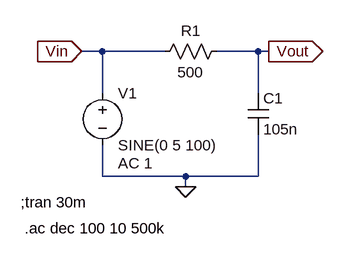
[diagram p0: schematic Draft10.asc]
Draft10.asc, the LTspice schematic file:
Version 4
SHEET 1 880 680
WIRE 16 48 -16 48
WIRE 112 48 16 48
WIRE 256 48 192 48
WIRE 272 48 256 48
WIRE 16 112 16 48
WIRE 256 112 256 48
WIRE 16 240 16 192
WIRE 144 240 16 240
WIRE 256 240 256 176
WIRE 256 240 144 240
WIRE 144 256 144 240
FLAG 144 256 0
FLAG -16 48 Vin
IOPIN -16 48 In
FLAG 272 48 Vout
IOPIN 272 48 Out
SYMBOL res 208 32 R90
WINDOW 0 0 56 VBottom 2
WINDOW 3 32 56 VTop 2
SYMATTR InstName R1
SYMATTR Value 500
SYMBOL cap 240 112 R0
SYMATTR InstName C1
SYMATTR Value 105n
SYMBOL voltage 16 96 R0
WINDOW 123 24 124 Left 2
WINDOW 39 0 0 Left 0
SYMATTR InstName V1
SYMATTR Value SINE(0 5 100)
SYMATTR Value2 AC 1
TEXT -110 280 Left 2 !;tran 30m
TEXT -104 320 Left 2 !.ac dec 100 10 500k

The netlist it stands for:
* Draft10.asc
R1 Vout Vin 500
C1 Vout 0 105n
V1 Vin 0 SINE(0 5 100) AC 1
;tran 30m
.ac dec 100 10 500k
.backanno
.end

* Results of the author's LTspice run, read from the files saved beside the schematic
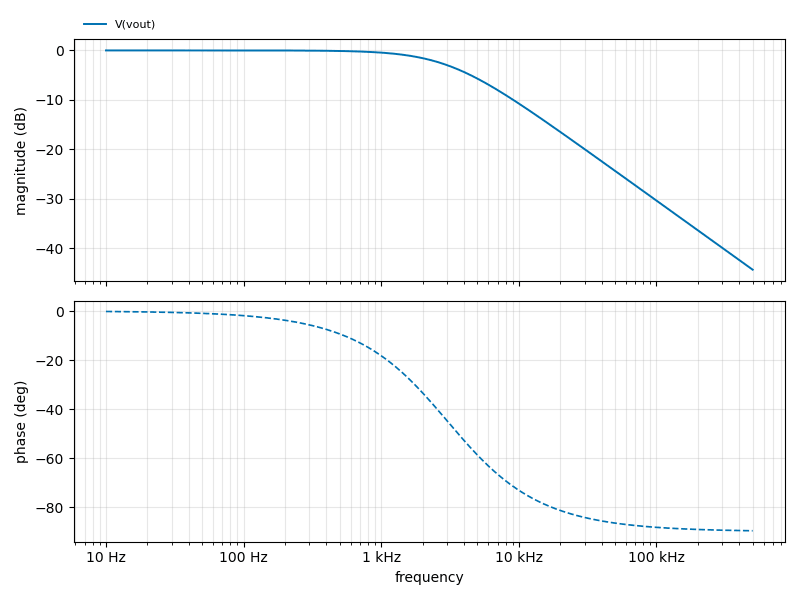
[diagram p1: AC Analysis of Draft10.asc, plotted from the saved traces]
* AC Analysis, 1 run:
*   V(vout): -0.00 dB at 10 Hz, -44.35 dB at 500 kHz, peak -0.00 dB at 10 Hz, 3 dB below the peak at 3.031 kHz